# EAGLE design raspberry_XCopter_26Pin_V2 (EAGLE 5.09)
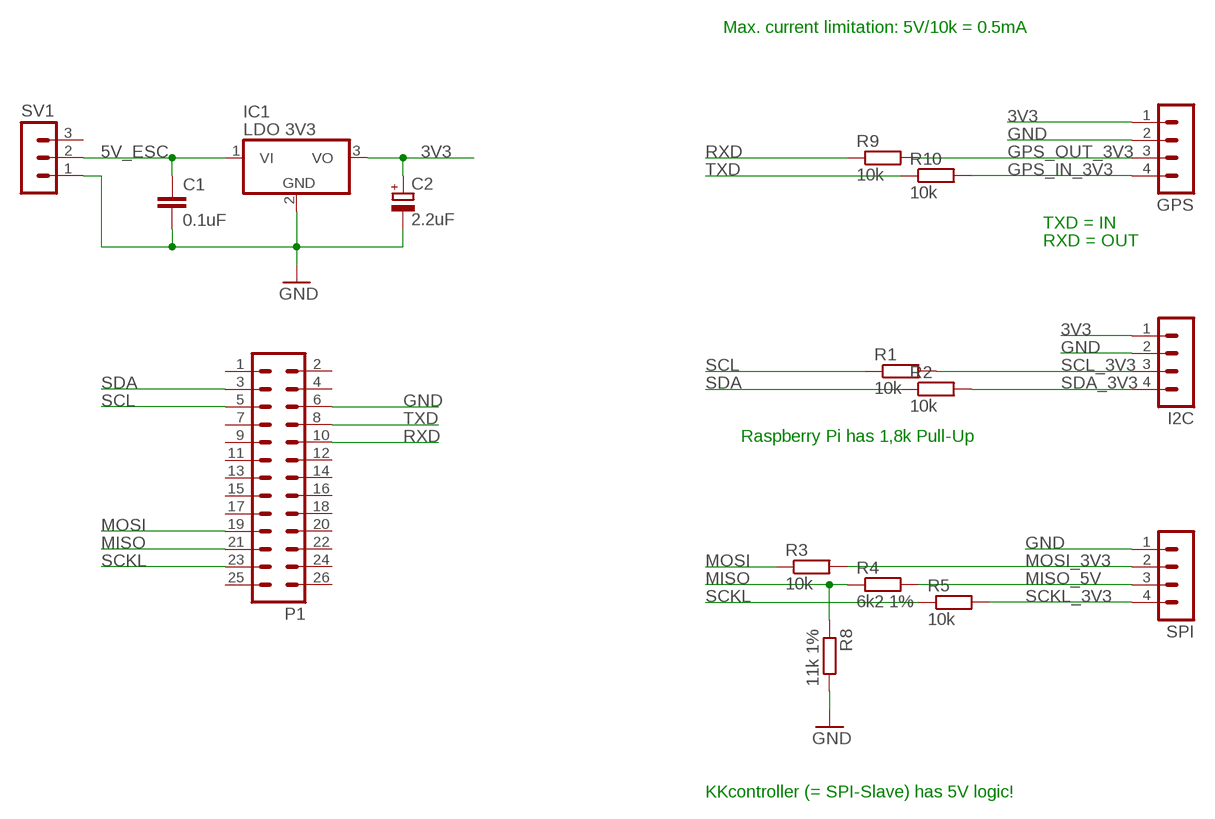
[diagram p0: schematic, sheet 1]

## Parts
C1  0.1uF  C-EU025-024X044  [C025-024X044]
C2  2.2uF  CPOL-EUE2,5-6E  [E2,5-6E]
GPS  MA04-1  [MA04-1]
I2C  MA04-1  [MA04-1]
IC1  LDO 3V3  7818T  [TO220H]
P1  MA13-2  [MA13-2]
R1  10k  R-EU_0204/7  [0204/7]
R2  10k  R-EU_0204/7  [0204/7]
R3  10k  R-EU_0204/7  [0204/7]
R4  6k2 1%  R-EU_0204/7  [0204/7]
R5  10k  R-EU_0204/7  [0204/7]
R8  11k 1%  R-EU_0204/7  [0204/7]
R9  10k  R-EU_0204/7  [0204/7]
R10  10k  R-EU_0204/7  [0204/7]
SPI  MA04-1  [MA04-1]
SV1  MA03-1  [MA03-1]

## Nets
3V3: C2.+ GPS.1 I2C.1 IC1.3(VO)
5V_ESC: C1.1 IC1.1(VI) SV1.2
GND: C1.2 C2.- GPS.2 I2C.2 IC1.2(GND) P1.6 R8.2 SPI.1 SV1.1
GPS_IN_3V3: GPS.4 R10.2
GPS_OUT_3V3: GPS.3 R9.2
MISO: P1.21 R4.1 R8.1
MISO_5V: R4.2 SPI.3
MOSI: P1.19 R3.1
MOSI_3V3: R3.2 SPI.2
RXD: P1.10 R9.1
SCKL: P1.23 R5.1
SCKL_3V3: R5.2 SPI.4
SCL: P1.5 R1.1
SCL_3V3: I2C.3 R1.2
SDA: P1.3 R2.1
SDA_3V3: I2C.4 R2.2
TXD: P1.8 R10.1
Unconnected: P1.1 P1.2 P1.4 P1.7 P1.9 P1.11 P1.12 P1.13 P1.14 P1.15 P1.16 P1.17 P1.18 P1.20 P1.22 P1.24 P1.25 P1.26 SV1.3

## Notes on the sheet
- Max. current limitation: 5V/10k = 0.5mA
- TXD = IN
- RXD = OUT
- Raspberry Pi has 1,8k Pull-Up
- KKcontroller (= SPI-Slave) has 5V logic!

## Library data of the parts
C1 = rcl:C-EU: CAPACITOR, European symbol
C2 = rcl:CPOL-EU: POLARIZED CAPACITOR, European symbol
GPS I2C SPI = con-lstb:MA04-1: PIN HEADER
IC1 = linear:78*: Positive VOLTAGE REGULATOR Source: http://cache.national.com/ds/LM/LM78L05.pdf http://www.fairchildsemi.com/ds/LM/LM7805.pdf
P1 = con-lstb:MA13-2: PIN HEADER
R1-R5 R8-R10 = rcl:R-EU_: RESISTOR, European symbol
SV1 = con-lstb:MA03-1: PIN HEADER

## Board
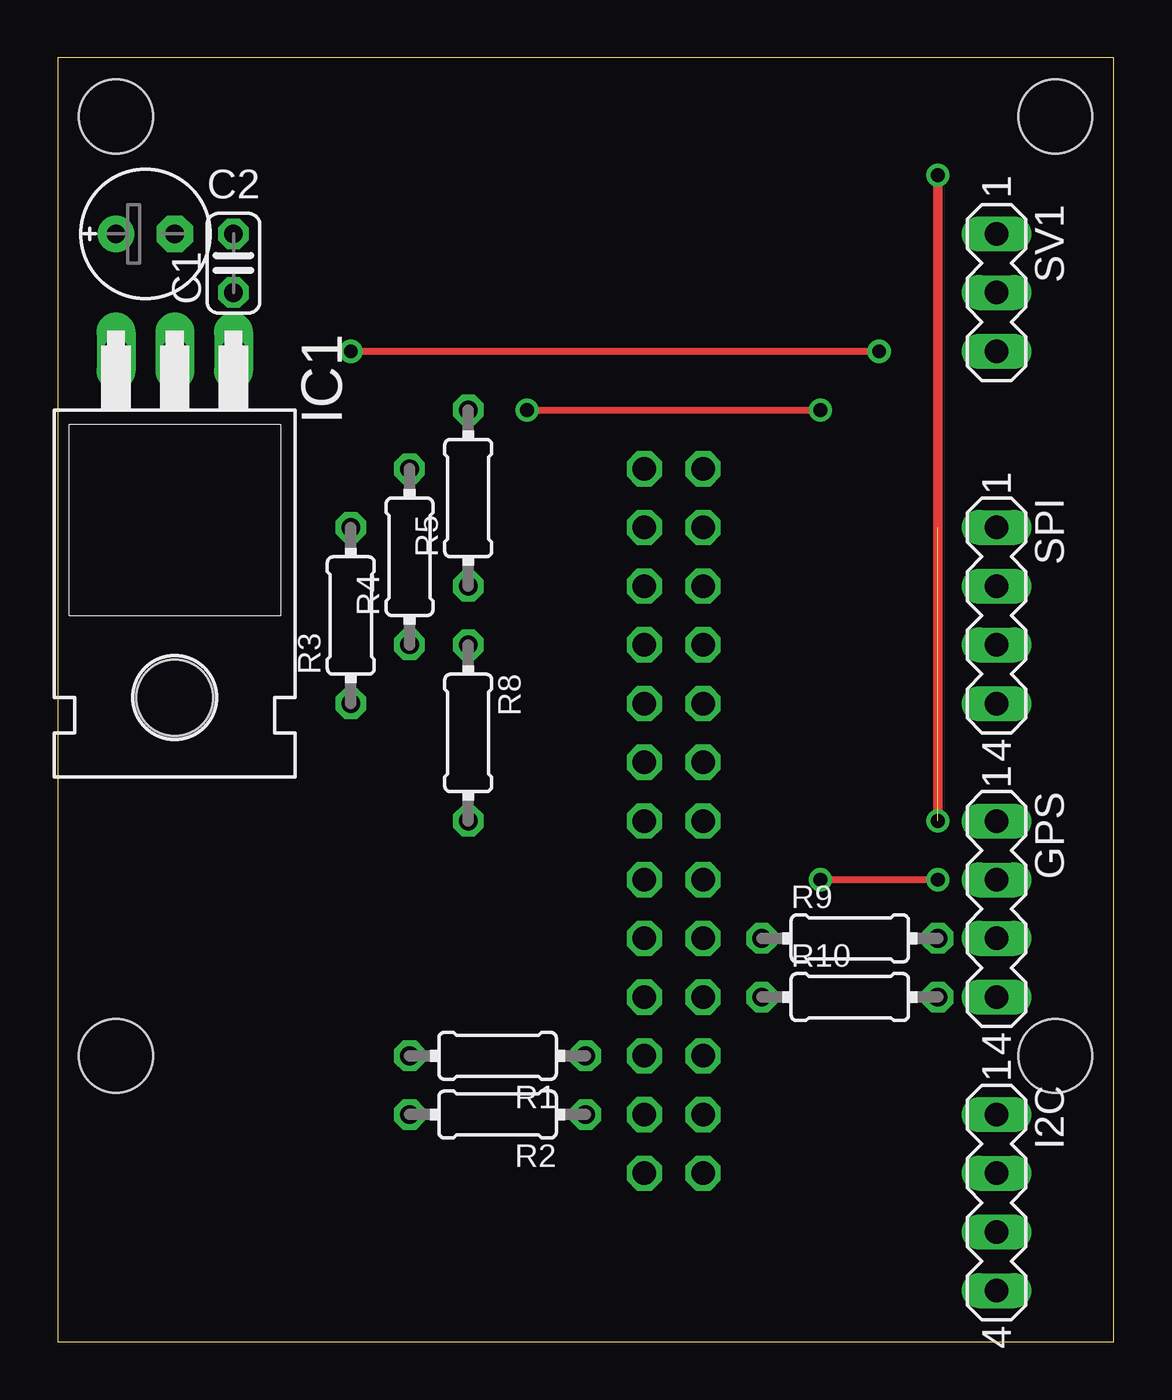
[diagram p1: board, top side]
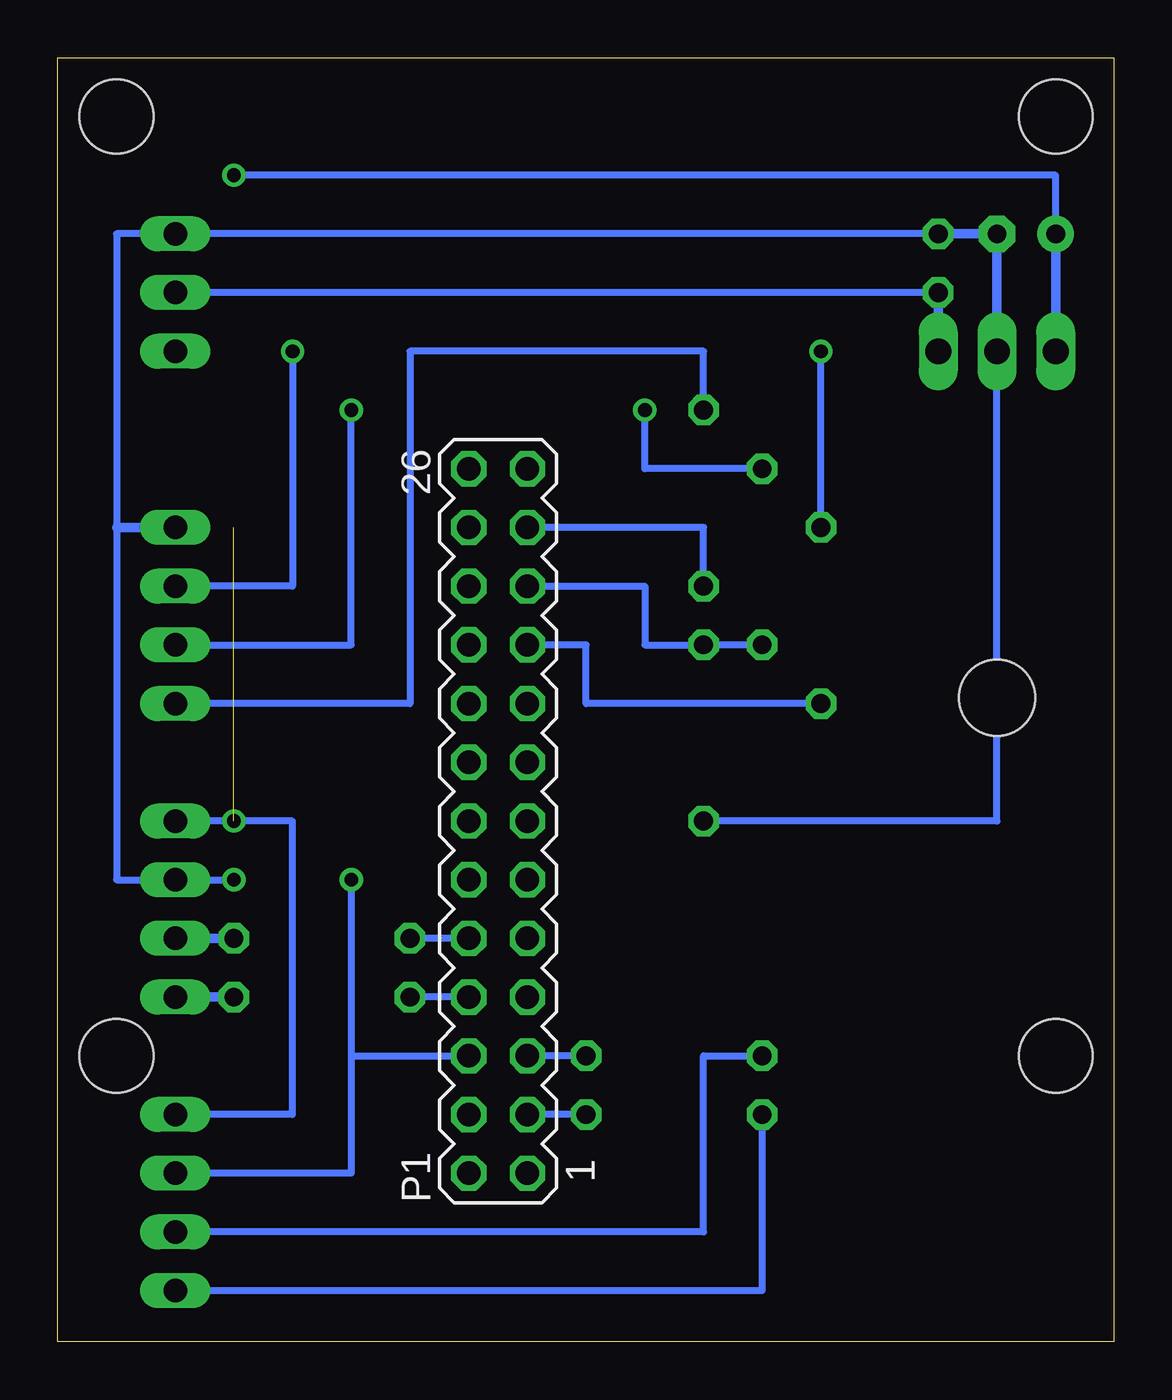
[diagram p2: board, bottom side, seen from below]

Size 45.7 x 55.55 mm. Coordinates in mm from the lower left corner, seen from the top.
Outline: 45.7,55.55 0,55.55 0,0 45.7,0 45.7,55.55
Copper layers (1*16): Top 0.035mm / dielectric 1.5mm / Bottom 0.035mm
Design rules "default": minimum track width 10mil, minimum drill 24mil, track to track 8mil, track to pad 8mil, pad to pad 8mil, via to via 8mil, smd to smd 8mil, copper to edge 40mil, drill to drill 8mil, minimum pad ring 10mil, minimum via ring 8mil, stop-mask expansion 4mil, vias tented up to drill 0mil, thermal gap 10mil
Holes 3.2 mm at 2.52,53.01 43.16,12.37 2.52,12.37 43.16,53.01

### Footprints (pad centres in the part's own frame; a part is rotated, then mirrored left to right if it is on the bottom)
C025-024X044 = drill 0.813 octagon: 1 -1.27,0; 2 1.27,0
E2,5-6E = drill 0.813 pad 1.575 round: + -1.27,0 | drill 0.813 pad 1.575 octagon: - 1.27,0
MA04-1 = drill 1.016 long: 1 -3.81,0; 2 -1.27,0; 3 1.27,0; 4 3.81,0
TO220H = drill 1.118 long: 1 -2.54,-10.16; 2 0,-10.16; 3 2.54,-10.16 | hole 3.302: 0,4.826
MA13-2 = drill 1.016 octagon: 1 -15.24,-1.27; 2 -15.24,1.27; 3 -12.7,-1.27; 4 -12.7,1.27; 5 -10.16,-1.27; 6 -10.16,1.27; 7 -7.62,-1.27; 8 -7.62,1.27; 9 -5.08,-1.27; 10 -5.08,1.27; 11 -2.54,-1.27; 12 -2.54,1.27; 13 0,-1.27; 14 0,1.27; 15 2.54,-1.27; 16 2.54,1.27; 17 5.08,-1.27; 18 5.08,1.27; 19 7.62,-1.27; 20 7.62,1.27; 21 10.16,-1.27; 22 10.16,1.27; 23 12.7,-1.27; 24 12.7,1.27; 25 15.24,-1.27; 26 15.24,1.27
0204/7 = drill 0.813 octagon: 1 -3.81,0; 2 3.81,0
MA03-1 = drill 1.016 long: 1 -2.54,0; 2 0,0; 3 2.54,0

### Placement (x,y rotation side)
C1  7.6,46.66 90 top
C2  3.79,47.93 0 top
GPS  40.62,18.72 270 top
I2C  40.62,6.02 270 top
IC1  5.06,32.69 180 top
P1  26.65,22.53 90 bottom
R1  19.03,12.37 180 top
R2  19.03,9.83 180 top
R3  12.68,31.42 90 top
R4  15.22,33.96 90 top
R5  17.76,36.5 90 top
R8  17.76,26.34 270 top
R9  34.27,17.45 0 top
R10  34.27,14.91 0 top
SPI  40.62,31.42 270 top
SV1  40.62,45.39 270 top

### Tracks (layer width: path | path; a pad name or v marks a point on that pad's centre or on a via)
3V3  (via drill 0.6)  (2 unrouted)
  Top 0.406: v38.08,50.47 v38.08,22.53
  Bottom 0.3: I2C.1 35.54,9.83 35.54,22.53 v38.08,22.53 GPS.1 | v38.08,50.47 2.52,50.47 C2.+
  Bottom 0.406: IC1.3 C2.+
5V_ESC
  Bottom 0.3: C1.1 SV1.2
  Bottom 0.406: IC1.1 C1.1
GND  (via drill 0.6)
  Top 0.3: v38.08,19.99 v33,19.99
  Bottom 0.3: 33,12.37 P1.6 | 33,12.37 33,7.29 I2C.2 | v38.08,19.99 GPS.2 43.16,19.99 43.16,35.23 43.16,47.93 SV1.1 C1.2 | v33,19.99 33,12.37
  Bottom 0.305: R8.2 5.06,22.53 IC1.2
  Bottom 0.406: C1.2 C2.- IC1.2 | 43.16,35.23 SPI.1
GPS_IN_3V3
  Bottom 0.406: R10.2 GPS.4
GPS_OUT_3V3
  Bottom 0.406: R9.2 GPS.3
MISO
  Bottom 0.3: R4.1 R8.1
  Bottom 0.305: P1.21 20.3,32.69 20.3,30.15 R8.1
MISO_5V  (via drill 0.6)
  Top 0.3: v20.3,40.31 v33,40.31
  Bottom 0.3: R4.2 20.3,37.77 v20.3,40.31
  Bottom 0.305: SPI.3 33,30.15 v33,40.31
MOSI
  Bottom 0.3: R3.1 22.84,27.61 22.84,30.15 P1.19
MOSI_3V3  (via drill 0.6)
  Top 0.3: v12.68,42.85 v35.54,42.85
  Bottom 0.3: SPI.2 35.54,32.69 v35.54,42.85 | R3.2 v12.68,42.85
RXD
  Bottom 0.3: P1.10 R9.1
SCKL
  Bottom 0.3: R5.1 17.76,35.23 P1.23
SCKL_3V3
  Bottom 0.3: SPI.4 30.46,27.61 30.46,42.85 17.76,42.85 R5.2
SCL
  Bottom 0.3: R1.1 P1.5
SCL_3V3
  Bottom 0.3: I2C.3 17.76,4.75 17.76,12.37 R1.2
SDA
  Bottom 0.3: R2.1 P1.3
SDA_3V3
  Bottom 0.3: I2C.4 15.22,2.21 R2.2
TXD
  Bottom 0.3: P1.8 R10.1